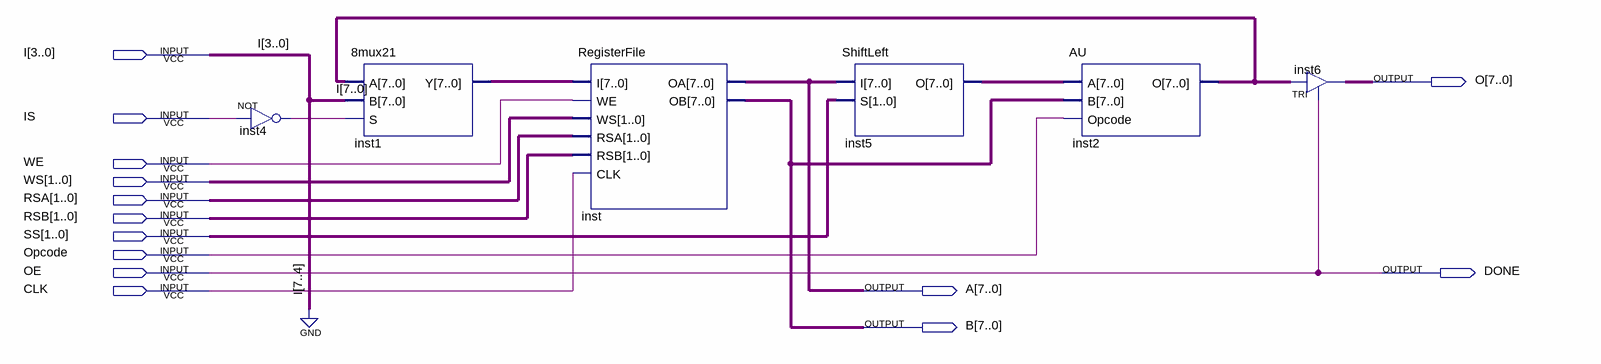
[diagram p0: schematic sheet]
// Quartus schematic Datapath.bdf as structural Verilog: 6 symbols, 14 pins
module Datapath (
  input  [3:0] I,
  input  IS,
  input  WE,
  input  [1:0] WS,
  input  [1:0] RSA,
  input  [1:0] RSB,
  input  [1:0] SS,
  input  Opcode,
  input  OE,
  input  CLK,
  output [7:0] O,
  output DONE,
  output [7:0] A,
  output [7:0] B
);

  wire inst4_out;
  wire [7:0] inst1_y, inst2_o, inst5_o;

  not inst4 (inst4_out, IS);
  \8mux21  inst1 (.A(inst2_o), .B({4'b0000, I}), .S(inst4_out), .Y(inst1_y));
  RegisterFile inst (.I(inst1_y), .WE(WE), .WS(WS), .RSA(RSA), .RSB(RSB), .CLK(CLK), .OA(A), .OB(B));
  ShiftLeft inst5 (.I(A), .S(SS), .O(inst5_o));
  AU inst2 (.A(inst5_o), .B(B), .Opcode(Opcode), .O(inst2_o));
  TRI inst6[7:0] (.IN(inst2_o), .OE(OE), .OUT(O));

  assign DONE = OE;
endmodule
